# Altium project buck_boost_synchronous.PrjPcb
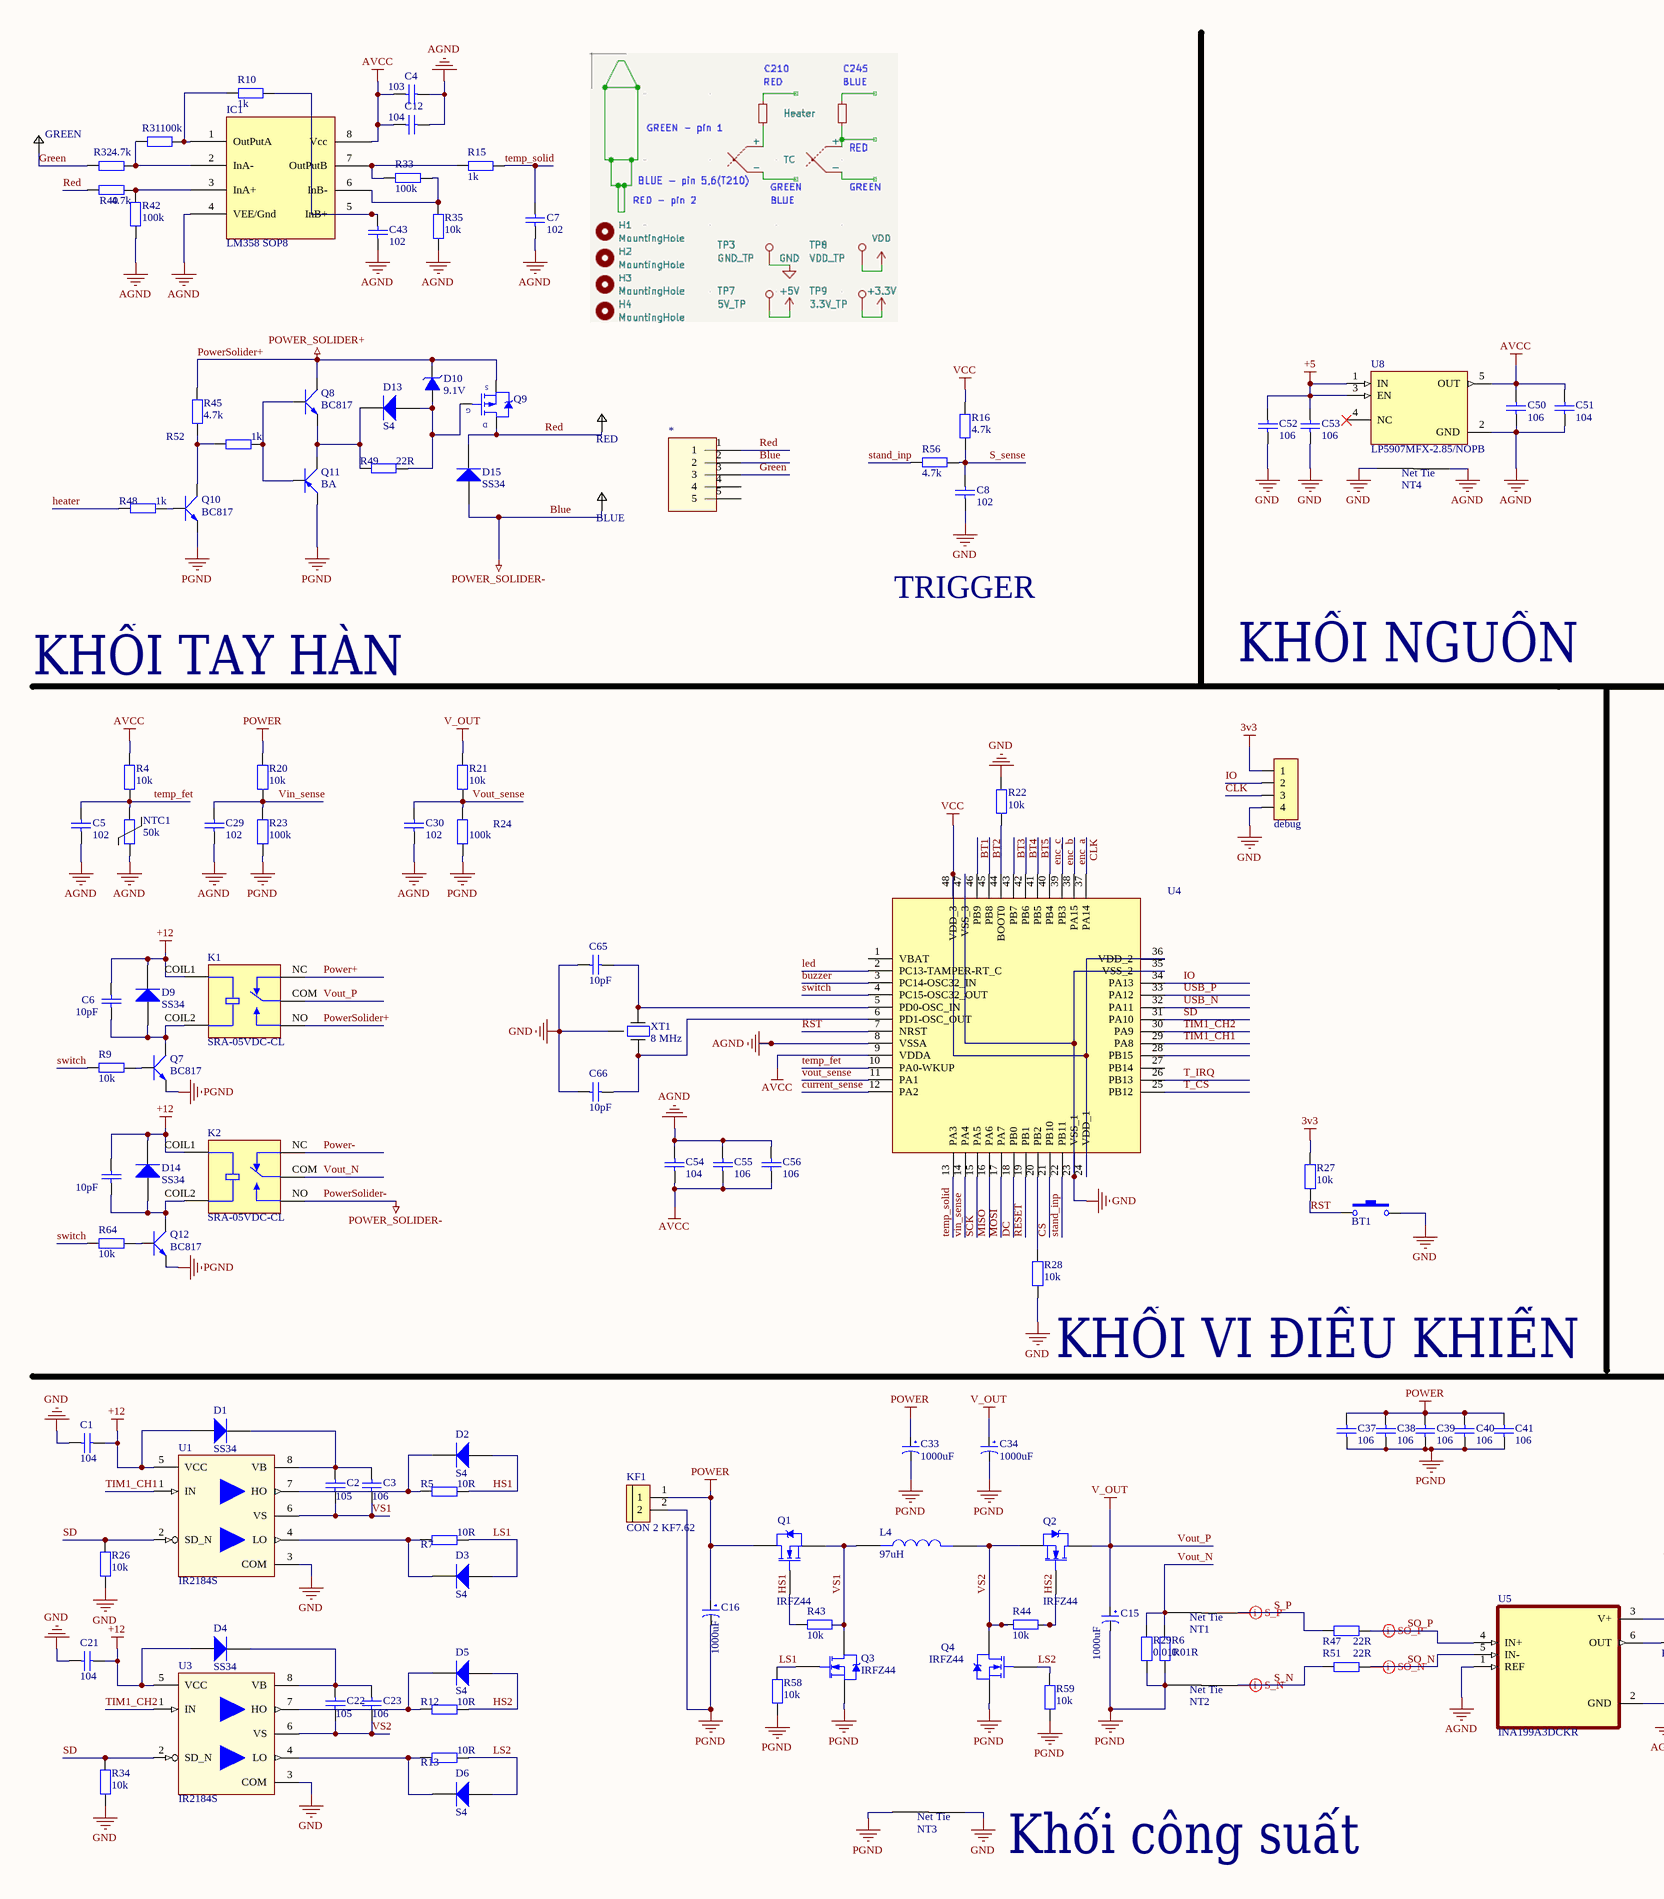
[diagram p0: Main.SchDoc, left]
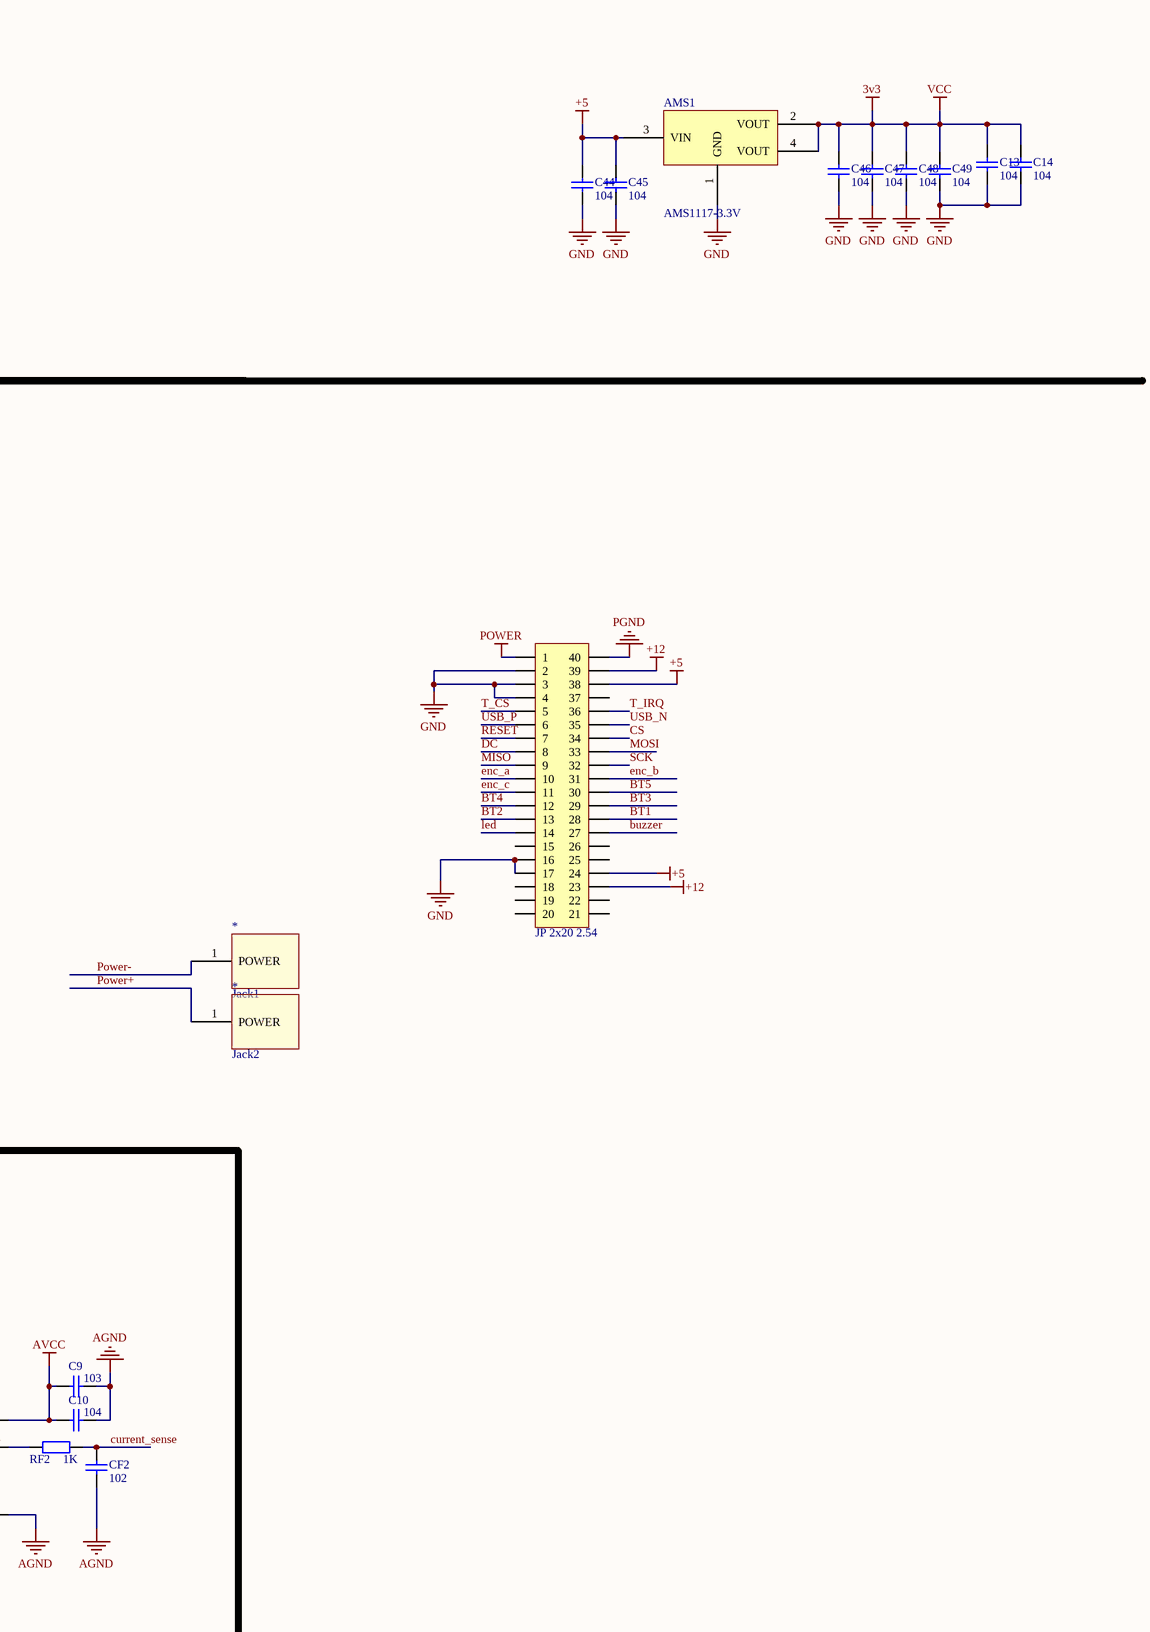
[diagram p1: Main.SchDoc, right]
1 sheet, 131 parts. Net scope: global (net labels, ports and power ports of the same name join across sheets).
Board files: PCB3_3D.PcbDoc, PCB3.PcbDoc

## Sheet Main.SchDoc
size A2; SheetNumber: 1; SheetTotal: 1

### Parts
(Parts that share a designator on the sheet are numbered #1, #2 ... from top to bottom, then left to right.)
*#1  Component_1  [GX_12Jack?]  (value not drawn)
*#2  Jack1  [jack_coc_loa]
*#3  Jack2  [jack_coc_loa]
AMS1  AMS1117-3.3V  [SOT223]
BLUE  TestPoin  [TP-60]  (value not drawn)
BT1  Nut Nhan 2 Chan SMD 3x6x2.5  [Nut Nhan 2 Chan SMD 3x6x2.5]  (value not drawn)
C1  104  [tu 0603]
C2  105  [tu 0603]
C3  106  [tu 0805]
C4  103  [tu 0603]
C5  102  [tu 0603]
C6  10pF  [tu 0805]
C7  102  [tu 0603]
C8  102  [tu 0603]
C9  103  [tu 0603]
C10  104  [tu 0603]
C12  104  [tu 0603]
C13  104  [tu 0603]
C14  104  [tu 0603]
C15  1000uF  [tu hoa 10mm]
C16  1000uF  [tu hoa 10mm]
C21  104  [tu 0603]
C22  105  [tu 0603]
C23  106  [tu 0805]
C29  102  [tu 0603]
C30  102  [tu 0603]
C33  1000uF  [tu hoa 13mm]
C34  1000uF  [tu hoa 13mm]
C37  106  [tu 0805]
C38  106  [tu 0805]
C39  106  [tu 0805]
C40  106  [tu 0805]
C41  106  [tu 0805]
C43  102  [tu 0603]
C44  104  [tu 0603]
C45  104  [tu 0603]
C46  104  [tu 0603]
C47  104  [tu 0603]
C48  104  [tu 0603]
C49  104  [tu 0603]
C50  106  [tu 0603]
C51  104  [tu 0603]
C52  106  [tu 0603]
C53  106  [tu 0603]
C54  104  [tu 0603]
C55  106  [tu 0603]
C56  106  [tu 0603]
C65  10pF  [tu 0603]
C66  10pF  [tu 0603]
CF2  102  [tu 0603]
D1  SS34  [DIODE SMA]
D2  S4  [DIODE SOD-123]
D3  S4  [DIODE SOD-123]
D4  SS34  [DIODE SMA]
D5  S4  [DIODE SOD-123]
D6  S4  [DIODE SOD-123]
D9  SS34  [DIODE SMA]
D10  9.1V  [DIODE ZENNER SMD SOD80]
D13  S4  [DIODE SOD-123]
D14  SS34  [DIODE SMA]
D15  SS34  [DIODE SMA]
GREEN  TestPoin  [TP-60]  (value not drawn)
IC1  LM358 SOP8  [SOP 8]
JP1  debug  [JP 1x4 DT]
JP?  JP 2x20 2.54  [JP 2x20 DT]
K1  SRA-05VDC-CL  [RELAY_SRA-05VDC-CL]
K2  SRA-05VDC-CL  [RELAY_SRA-05VDC-CL]
KF1  CON 2 KF7.62  [CON 2 KF7.62]
L4  97uH  [IND_ATCA-08-750M-V]
NT1  0.25mm  [NetTie_0.25mm]  (value not drawn)  (net tie, no BOM)
NT2  0.25mm  [NetTie_0.25mm]  (value not drawn)  (net tie, no BOM)
NT3  NetTie_2mm  [NetTie_2mm]  (value not drawn)  (net tie, no BOM)
NT4  0.25mm  [NetTie_0.25mm]  (value not drawn)  (net tie, no BOM)
NTC1  50k  [MF52]
Q1  IRFZ44  [TO220]
Q2  IRFZ44  [TO220]
Q3  IRFZ44  [TO220]
Q4  IRFZ44  [TO220]
Q7  BC817  [SOT-23]
Q8  BC817  [SOT-23]
Q9  IRF4905S  [D2PACK]  (value not drawn)
Q10  BC817  [SOT-23]
Q11  BA  [SOT23]
Q12  BC817  [SOT-23]
R4  10k  [tro smd 0603]
R5  10R  [Tro smd 0603]
R6  0.01R  [tro smd 2512]
R7  10R  [Tro smd 0603]
R9  10k  [Tro smd 0603]
R10  1k  [Tro smd 0603]
R12  10R  [Tro smd 0603]
R13  10R  [Tro smd 0603]
R15  1k  [Tro smd 0603]
R16  4.7k  [Tro smd 0603]
R20  10k  [tro smd 0603]
R21  10k  [tro smd 0603]
R22  10k  [Tro smd 0603]
R23  100k  [tro smd 0603]
R24  100k  [tro smd 0603]
R26  10k  [Tro smd 0603]
R27  10k  [Tro smd 0603]
R28  10k  [Tro smd 0603]
R29  0.01R  [tro smd 2512]
R31  100k  [Tro smd 0603]
R32  4.7k  [Tro smd 0603]
R33  100k  [Tro smd 0603]
R34  10k  [Tro smd 0603]
R35  10k  [Tro smd 0603]
R40  4.7k  [Tro smd 0603]
R42  100k  [Tro smd 0603]
R43  10k  [tro smd 0603]
R44  10k  [tro smd 0603]
R45  4.7k  [Tro smd 0603]
R47  22R  [Tro smd 0603]
R48  1k  [Tro smd 0603]
R49  22R  [Tro smd 0603]
R51  22R  [Tro smd 0603]
R52  1k  [Tro smd 0603]
R56  4.7k  [Tro smd 0603]
R58  10k  [tro smd 0603]
R59  10k  [tro smd 0603]
R64  10k  [Tro smd 0603]
RED  TestPoin  [TP-60]  (value not drawn)
RF2  1K  [Tro smd 0603]
U1  IR2184S  [SOIC127P600X175-8N-12-V]
U3  IR2184S  [SOIC127P600X175-8N-12-V]
U4  STM32F103C8T6  [LQFP-48_19.6_393_58X11_SMD]  (value not drawn)
U5  INA199A3DCKR  [SOT65P210X110-6N]
U8  LP5907MFX-2.85/NOPB  [SOT95P280X145-5N]
XT1  8 MHz  [DFN220P320X110-4N]
  10pF  [tu 0805]

### Nets
3v3: AMS1.2(VOUT) AMS1.4(VOUT) C13.1 C14.1 C46.1 C47.1 C48.1 C49.1 JP1.1 R16.2 R27.2 U4.24(VDD_1) U4.36(VDD_2) U4.48(VDD_3)  [also labelled VCC]
+5: AMS1.3(VIN) C44.1 C45.1 C52.1 C53.1 JP?.24 JP?.38 U8.1(IN) U8.3(EN)
+12: C1.2 C6.1 C21.2 D1.1(A) D4.1(A) D9.2(K) D14.2(K) JP?.23 JP?.39 K1.COIL1 K2.COIL1 U1.5(VCC) U3.5(VCC) .1
AGND: C4.2 C5.1 C7.1 C9.2 C10.2 C12.2 C29.1 C30.1 C43.1 C50.2 C51.2 C54.2 C55.2 C56.2 CF2.1 IC1.4(VEE/Gnd) NT4.2 NTC1.1 R35.2 R42.2 U4.8(VSSA) U5.1(REF) U5.2(GND) U8.2(GND)
AVCC: C4.1 C9.1 C10.1 C12.1 C50.1 C51.1 C54.1 C55.1 C56.1 IC1.8(Vcc) R4.1 U4.9(VDDA) U5.3(V+) U8.5(OUT)
Blue: *#1.2 BLUE.1 D15.1(A) K2.NO  [also labelled POWER_SOLIDER-, PowerSolider-]
GND: AMS1.1(GND) BT1.2 C1.1 C8.1 C13.2 C14.2 C21.1 C44.2 C45.2 C46.2 C47.2 C48.2 C49.2 C52.2 C53.2 C65.2 C66.2 JP1.4 JP?.2 JP?.3 JP?.4 JP?.16 JP?.17 NT3.2 NT4.1 R22.2 R26.1 R28.1 R34.1 U1.3(COM) U3.3(COM) U4.23(VSS_1) U4.35(VSS_2) U4.47(VSS_3) XT1.G
PGND: C15.2 C16.2 C33.2 C34.2 C37.2 C38.2 C39.2 C40.2 C41.2 JP?.40 KF1.2 NT2.1 NT3.1 Q3.3(S) Q4.3(S) Q7.2(E) Q10.2(E) Q11.2(E) Q12.2(E) R6.1 R23.2 R24.2 R29.1 R58.2 R59.2
POWER: C16.1 C33.1 C37.1 C38.1 C39.1 C40.1 C41.1 JP?.1 KF1.1 Q1.2(D) R20.1
PowerSolider+: D10.2(K) K1.NO Q8.3(C) Q9.3(S) R45.2  [also labelled POWER_SOLIDER+]
Vout_P: C15.1 C34.1 K1.COM Q2.2(D) R21.1  [also labelled V_OUT]
BT1: JP?.28 U4.46(PB9)
BT2: JP?.13 U4.45(PB8)
BT3: JP?.29 U4.43(PB7)
BT4: JP?.12 U4.42(PB6)
BT5: JP?.30 U4.41(PB5)
buzzer: JP?.27 U4.3(PC14-OSC32_IN)
CLK: JP1.3 U4.37(PA14)
CS: JP?.34 U4.21(PB10)
current_sense: CF2.2 RF2.2 U4.12(PA2)
DC: JP?.8 U4.18(PB0)
enc_a: JP?.10 U4.38(PA15)
enc_b: JP?.31 U4.39(PB3)
enc_c: JP?.11 U4.40(PB4)
Green: *#1.3 GREEN.1 R32.2
heater: R48.1
HS1: D2.1(A) Q1.1(G) R5.2 R43.1
HS2: D5.1(A) Q2.1(G) R12.2 R44.2
IO: JP1.2 U4.34(PA13)
led: JP?.14 U4.2(PC13-TAMPER-RT_C)
LS1: D3.1(A) Q3.1(G) R7.2 R58.1
LS2: D6.1(A) Q4.1(G) R13.2 R59.1
MISO: JP?.9 U4.16(PA6)
MOSI: JP?.33 U4.17(PA7)
Power+: *#3.1(POWER) K1.NC
Power-: *#2.1(POWER) K2.NC
Red: *#1.1 D15.2(K) Q9.2(D) R40.2 RED.1
RESET: JP?.7 U4.19(PB1)
RST: BT1.1 R27.1 U4.7(NRST)
S_N: NT2.2 R51.1
S_P: NT1.2 R47.1
S_sense: C8.2 R16.1 R56.1
SCK: JP?.32 U4.15(PA5)
SD: R26.2 R34.2 U1.2(SD_N) U3.2(SD_N) U4.31(PA10)
SO_N: R51.2 U5.5(IN-)
SO_P: R47.2 U5.4(IN+)
stand_inp: R56.2 U4.22(PB11)
switch: R9.2 R64.2 U4.4(PC15-OSC32_OUT)
T_CS: JP?.5 U4.25(PB12)
T_IRQ: JP?.36 U4.26(PB13)
temp_fet: C5.2 NTC1.2 R4.2 U4.10(PA0-WKUP)
temp_solid: C7.2 R15.2 U4.13(PA3)
TIM1_CH1: U1.1(IN) U4.29(PA8)
TIM1_CH2: U3.1(IN) U4.30(PA9)
USB_N: JP?.35 U4.32(PA11)
USB_P: JP?.6 U4.33(PA12)
Vin_sense: C29.2 R20.2 R23.1 U4.14(PA4)
Vout_N: K2.COM NT1.1 R6.2 R29.2
Vout_sense: C30.2 R21.2 R24.1 U4.11(PA1)
VS1: C2.1 C3.2 L4.1 Q1.3(S) Q3.2(D) R43.2 U1.6(VS)
VS2: C22.1 C23.2 L4.2 Q2.3(S) Q4.2(D) R44.1 U3.6(VS)
NetC2_2: C2.2 C3.1 D1.2(K) U1.8(VB)
NetC6_2: C6.2 D9.1(A) K1.COIL2 Q7.3(C)
NetC22_2: C22.2 C23.1 D4.2(K) U3.8(VB)
NetC43_2: C43.2 IC1.5(InB+) R10.1
NetC65_1: C65.1 U4.5(PD0-OSC_IN) XT1.1
NetC66_1: C66.1 U4.6(PD1-OSC_OUT) XT1.3
NetD2_2: D2.2(K) R5.1 U1.7(HO)
NetD3_2: D3.2(K) R7.1 U1.4(LO)
NetD5_2: D5.2(K) R12.1 U3.7(HO)
NetD6_2: D6.2(K) R13.1 U3.4(LO)
NetD10_1: D10.1(A) D13.1(A) Q9.1(G) R49.2
NetD13_2: D13.2(K) Q8.2(E) Q11.3(C) R49.1
NetD14_1: D14.1(A) K2.COIL2 Q12.3(C) .2
NetIC1_1: IC1.1(OutPutA) R10.2 R31.2
NetIC1_2: IC1.2(InA-) R31.1 R32.1
NetIC1_3: IC1.3(InA+) R40.1 R42.1
NetIC1_6: IC1.6(InB-) R33.2 R35.1
NetIC1_7: IC1.7(OutPutB) R15.1 R33.1
NetQ7_1: Q7.1(B) R9.1
NetQ8_1: Q8.1(B) Q11.1(B) R52.2
NetQ10_1: Q10.1(B) R48.2
NetQ10_3: Q10.3(C) R45.1 R52.1
NetQ12_1: Q12.1(B) R64.1
NetR22_1: R22.1 U4.44(BOOT0)
NetR28_2: R28.2 U4.20(PB2)
NetRF2_1: RF2.1 U5.6(OUT)

Not connected (* = marked no-connect by the designer): *#1 4 5; JP? 15 18 19 20 21 22 25 26 37; U4 1(VBAT) 27(PB14) 28(PB15); U8 4(NC)*

### Layout directives
differential pair: S_N, S_P, SO_N, SO_P

### Notes on the sheet
- TRIGGER
- KHỐI TAY HÀN
- KHỐI NGUỒN
- (near R28) KHỐI VI ĐIỀU KHIỂN
- Khối công suất
- (in symbol NetTie_0.25mm) Net Tie
- (in symbol NetTie_2mm) Net Tie

### Library data of the parts
*#2 *#3 = Jack?
AMS1 = AMS1117 SMD: Dán; Value: AMS1117-3.3V SOT223; Don_Vi: Con; Ma_Hang: MH000596; Ghi_Chu: *; Kieu_Chan: *; Chung_Loai: Dán
BT1 = Nut Nhan 2 Chan SMD 3x6x2.5: Ma_Hang: MH001036; Ten: Nút Nhấn 2 Chân 3x6x2.5MM SMD
C1 C2 C13 C14 C21 C22 C44-C49 = Tu 0603 101 50V 10%: Dán; Don_Vi: Con; So_Chan: 2; Ten_Linh_Kien: Tụ 0603 101-0.1nF 10% 50V; Ma_Hang: MH004565; Chung_Loai: Dán; Kieu_Chan: *
C3 C6 C23  = Tu 0805 101 50V 20%: Dán; Don_Vi: Con; So_Chan: 2; Ten_Linh_Kien: Tụ 0805 101-0.1nF 50V 20%; Ma_Hang: MH002806
C4 C7-C10 C12 C43 C50-C56 CF2 = Tu 0603 106 16V 20%: Dán; Don_Vi: Con; So_Chan: 2; Ten_Linh_Kien: Tụ 0603-10uF 20% 16V; Ma_Hang: MH004848; Chung_Loai: Dán; Kieu_Chan: *
C5 C29 C30 C65 C66 = Tu 0603 104 50V 10%: Dán; Don_Vi: Con; So_Chan: 2; Ten_Linh_Kien: Tụ 0603 104-100nF 10% 50V; Ma_Hang: MH004568; Chung_Loai: Dán; Kieu_Chan: *
C15 C16 = Tu Hoa 1000uF 10V 10x12: Cắm; So_Chan: 2; Don_Vi: Con; Ten_Linh_Kien: Tụ Hóa 1000uF 10V 10x12MM; Ma_Hang: MH006614; Kieu_Chan: *; Chung_Loai: Cắm
C33 C34 = Tu Hoa 1000uF 50V 13x26: Cắm; Don_Vi: Con; So_Chan: 2; Ten_Linh_Kien: Tụ Hóa 1000uF 50V; Ma_Hang: MH006619; Chung_Loai: Cắm; Kieu_Chan: *
C37-C41 = Tu 0805 106 16V 10%: Dán; Ten_Linh_Kien: Tụ 0805 106-10uF 10% 16V; So_Chan: 2; Don_Vi: Con; Ma_Hang: MH004553; Chung_Loai: Dán; Kieu_Chan: *
D1 D4 D9 D14 D15 = Diode SS34 ( 1N5822 ): Dán; Don_Vi: Con; Ma_Hang: MH002104; Ten_Linh_Kien: Diode SS34 3A 40V SMA ( 1N5822 SS34A); Kieu_Chan: *; Chung_Loai: Dán
D2 D3 D5 D6 D13 = Diode S4: Dán; Ten_Linh_Kien: Diode S4 SOD123 ( 1N5819 SOD123); Ma_Hang: MH005519; Don_Vi: Con; Ghi_Chu: *; Chung_Loai: Dán; Kieu_Chan: *
D10 = Diode Zener 9.1V: Dán; Don_Vi: Con; Ma_Hang: MH002882; Ten_Linh_Kien: Diode Zener 1/2W 9.1V SMD1206 ZMM9.1; Ghi_Chu: *; Chung_Loai: Dán; Kieu_Chan: *
IC1 = LM358 SOP8: Dán; Ma_Hang: MH000609; Don_Vi: Con; Ten_Linh_Kien: LM358 SOP8; Kieu_Chan: *; Ghi_Chu: *; Chung_Loai: Dán
JP1 = JP 1x4 2.54 Duc Thang: Cắm; Ten_Linh_Kien: Jump Đơn Đực 2.54MM 1x40P Thẳng 11MM; Don_Vi: Con; Ma_Hang: MH000903; Ghi_Chu: *; Kieu_Chan: *; Chung_Loai: Cắm
JP? = JP 2x20 2.54 Duc Thang: Cắm; Ten_Linh_Kien: Jump Đôi Đực 2.54MM 2x40P Thẳng 11MM; Don_Vi: Con; Ma_Hang: MH002686; Ghi_Chu: *; Kieu_Chan: *; Chung_Loai: Cắm
K1 K2 = SRA-05VDC-CL: MF: Songle Relay; SnapEDA_Link: https://www.snapeda.com/parts/SRA-05VDC-CL/Songle+Relay/view-part/?ref=snap; Package: Package; Value: *; MP: SRA-05VDC-CL; Check_prices: https://www.snapeda.com/parts/SRA-05VDC-CL/Songle+Relay/view-part/?ref=eda
KF1 = CON 2 KF7.62: Cắm; Ma_Hang: MH002053; Ten_Linh_Kien: CON 2 KF7.62-2P 7.62MM (Đen Thẳng); Chung_Loai: Cắm; Ghi_Chu: *; Kieu_Chan: *; Don_Vi: Con
L4 = ATCA-08-750M-V: Value: *; MP: ATCA-08-750M-V; Package: None; Availability: Unavailable; Price: None
NT1 NT2 NT4 = NetTie_0.25mm
NTC1 = NCP15XH103F03RC: THERMISTOR 10K OHM NTC 0402 SMD
Q1-Q4 = FET IRFZ44 DIP: TO-220
Q7 Q8 Q10 Q12 = Trans BC817: SOT-23 - C8658; Value: C9014
Q9 = IRF4905S: 55V 75A
Q11 = Trans A1015 BA SMD: PNP 600mW, ECB
R4 R20 R21 R23 R24 = Tro 0603 5% 10k: Dán; Don_Vi: Con; So_Chan: 2; Ten_Linh_Kien: Trở 0603 5% 10k; Ma_Hang: MH006316; Chung_Loai: Dán; Kieu_Chan: *
R5 R7 R9 R10 R12 R13 R15 R16 R22 R26-R28 R31-R35 R40 R42 R45 R47-R49 R51 R52 R56 R64 RF2 = Tro 0603 5% 10R: Dán; So_Chan: 2; Ten_Linh_Kien: Trở 0603 5% 10R; Ma_Hang: MH006317; Don_Vi: Con; Chung_Loai: Dán; Kieu_Chan: *
R6 R29 = Tro 2512 1% 0.01R: Dán; Don_Vi: Con; So_Chan: 2; Ten_Linh_Kien: Trở 2512 1% R010-0.01R 1W; Ma_Hang: MH004912; Chung_Loai: Dán; Kieu_Chan: *
R43 R44 R58 R59 = Tro 0603 1% 0R: Dán; Don_Vi: Con; So_Chan: 2; Ten_Linh_Kien: Trở 0603 1% 0R; Ma_Hang: MH005792; Chung_Loai: Dán; Kieu_Chan: *
U1 U3 = IR2184S: Half-Bridge Driver; Manufacturer: Infineon Technologies; Manufacturer Order Number: IR2184S; PackageReference: PG-DSO-8-910
U4 = IC_STM32F103C8T6: ARM® Cortex®-M3 STM32F1 Microcontroller IC 32-Bit 72MHz 64KB (64K x 8) FLASH 48-LQFP (7x7); Manufacturer: STMicroelectronics; Alternate Part Number-1: NA; Manufacturer Part Number: STM32F103C8T6; Case/Package: LQFP48; Supplier-1: LCSC; Supplier Part Number-1: STM32F103C8T6
U5 = INA199A3DCKR: 26V, bi-directional current sense amplifier; MF: Texas Instruments; SnapEDA_Link: https://www.snapeda.com/parts/INA199A3DCKR/Texas+Instruments/view-part/?ref=snap; Package: SOT-SC70-6 Texas Instruments; Value: *; MP: INA199A3DCKR; Check_prices: https://www.snapeda.com/parts/INA199A3DCKR/Texas+Instruments/view-part/?ref=eda
U8 = LP5907MFX-2.85/NOPB: 250-mA, low-noise, high-PSRR, ultra-low-dropout voltage regulator with low IQ and enable; MF: Texas Instruments; SnapEDA_Link: https://www.snapeda.com/parts/LP5907MFX-2.85/NOPB/Texas+Instruments/view-part/?ref=snap; Package: SOT-23-5 Texas Instruments; Value: *; MP: LP5907MFX-2.85/NOPB; Check_prices: https://www.snapeda.com/parts/LP5907MFX-2.85/NOPB/Texas+Instruments/view-part/?ref=eda
XT1 = ABM3B-8.000MHZ-10-1-U-T: Crystal 8MHz ±10ppm 10pF 200 Ohm -10°C ~ 60°C Surface Mount 4-SMD, No Lead (DFN, LCC); Manufacturer: Abracon LLC; Operating Mode: Fundamental; Value: 8 MHz; Supplier 1: Digi-Key; Supplier Part Number 1: 535-9721-1-ND; RoHS: RoHS Compliant; Category: Crystals, Oscillators, Resonators; Stock: 35437; Pricing 1: 1=0.69, 10=0.578, 50=0.5198, 100=0.462, 500=0.4389 (USD); Packaging: Cut Tape (CT); Part Status: Active; Type: MHz Crystal; Frequency Stability: ±10ppm; Frequency Tolerance: ±10ppm; Load Capacitance: 10pF; Operating Temperature: -10°C ~ 60°C; Ratings: -; Mounting Type: Surface Mount; Package / Case: 4-SMD, No Lead; Size / Dimension: 0.197" L x 0.126" W (5.00mm x 3.20mm); Height - Seated (Max): 0.043" (1.10mm); ComponentLink1URL: http://www.abracon.com/Resonators/abm3b.pdf; ComponentLink1Description: http://www.abracon.com/Resonators/abm3b.pdf; Supplier 2: Digi-Key; Supplier Part Number 2: 535-9721-2-ND; Pricing 2: 1000=0.336, 3000=0.315, 5000=0.3045, 10000=0.294 (USD); Manufacturer Part Number: ABM3B-8.000MHZ-10-1-U-T